# Altium schematic sheet isolated_rs485.SchDoc: foxBMS BMS-Extension
size A3; DocumentNumber: 9; SheetNumber: 9; SheetTotal: 14; Author: Fraunhofer IISB foxBMS Team; REL-DATE: 2017-05-16; VERSION: 1.0.2; GateName_1: G$1; SymbolName_1: FRAME_B_L; LibraryName: foxBMS_BMS-Master_V1.00_A; DeviceSetName: FRAME_B_L; GateName_2: G$2; SymbolName_2: DOCFIELD; SheetDescription: Isolated RS485
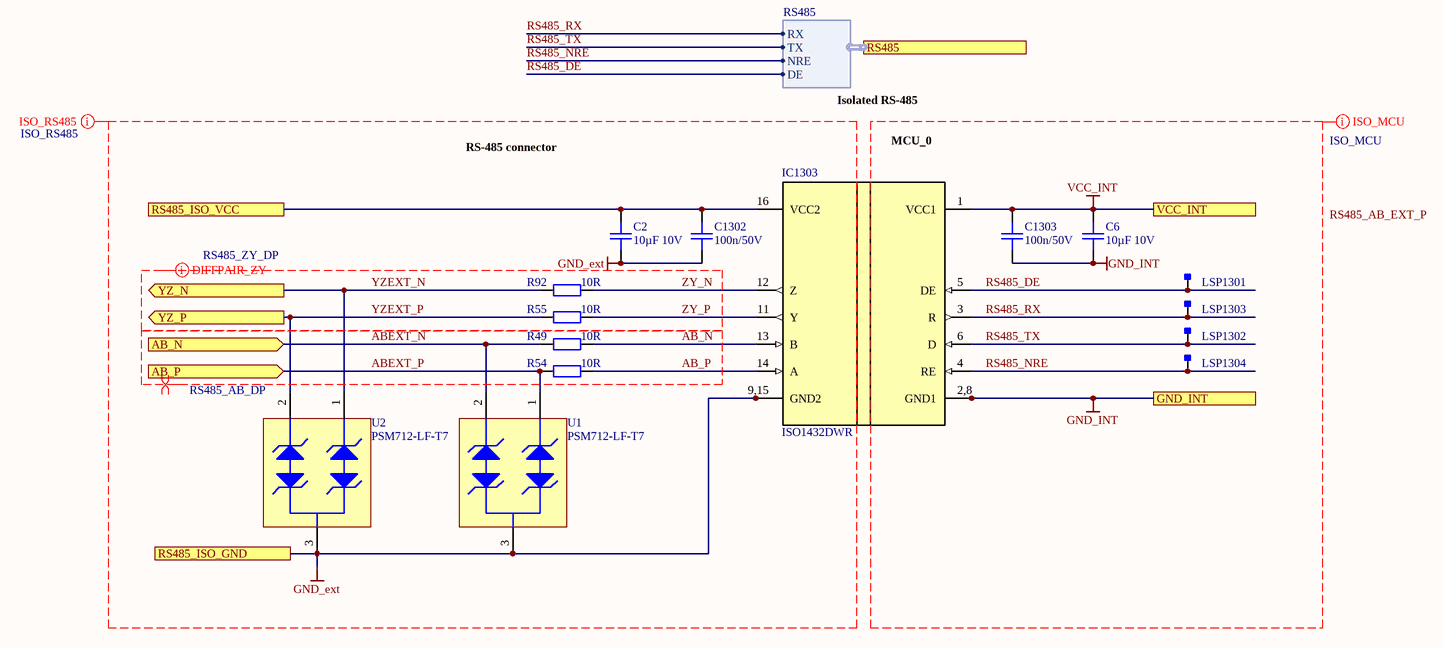
[diagram p0: isolated_rs485.SchDoc]

## Parts
C2  10µF 10V  [0805C]
C6  10µF 10V  [0805C]
C1302  100n/50V  [0603C]
C1303  100n/50V  [0603C]
IC1303  ISO1432DWR  [DW0016B_N]
LSP1301  Testpoint_Square  [Testpoint_S1]  (value not drawn)  (no BOM)
LSP1302  Testpoint_Square  [Testpoint_S1]  (value not drawn)  (no BOM)
LSP1303  Testpoint_Square  [Testpoint_S1]  (value not drawn)  (no BOM)
LSP1304  Testpoint_Square  [Testpoint_S1]  (value not drawn)  (no BOM)
R49  10R  [0603R]
R54  10R  [0603R]
R55  10R  [0603R]
R92  10R  [0603R]
U1  PSM712-LF-T7  [PRKT-SOT23-3_V]
U2  PSM712-LF-T7  [PRKT-SOT23-3_V]

## Ports
AB_N (in), AB_P (in), GND_INT, RS485 (harness RS485), RS485_ISO_GND, RS485_ISO_VCC, VCC_INT, YZ_N (out), YZ_P (out)

## Harnesses
RS485: RX, TX, NRE, DE

## Nets
GND_ext: C2.2 C1302.2 IC1303.9,15(GND2) IC1303.15 U1.3 U2.3 ; port RS485_ISO_GND
GND_INT: C6.2 C1303.2 IC1303.2,8(GND1) IC1303.8 ; port GND_INT
VCC_INT: C6.1 C1303.1 IC1303.1(VCC1) ; port VCC_INT
AB_N: IC1303.13(B) R49.2
AB_P: IC1303.14(A) R54.2
ABEXT_N: R49.1 U1.2 ; port AB_N
ABEXT_P: R54.1 U1.1 ; port AB_P
RS485_DE: IC1303.5(DE) LSP1301.1 ; port RS485.DE
RS485_ISO_VCC: C2.1 C1302.1 IC1303.16(VCC2) ; port RS485_ISO_VCC
RS485_NRE: IC1303.4(RE) LSP1304.1 ; port RS485.NRE
RS485_RX: IC1303.3(R) LSP1303.1 ; port RS485.RX
RS485_TX: IC1303.6(D) LSP1302.1 ; port RS485.TX
YZEXT_N: R92.1 U2.1 ; port YZ_N
YZEXT_P: R55.1 U2.2 ; port YZ_P
ZY_N: IC1303.12(Z) R92.2
ZY_P: IC1303.11(Y) R55.2

Not connected (* = marked no-connect by the designer): IC1303 7(NC) 10(NC)

## Layout directives
net class ISO_MCU: GND_INT, RS485_DE, RS485_NRE, RS485_RX, RS485_TX, VCC_INT
net class ISO_RS485: AB_N, AB_P, ABEXT_N, ABEXT_P, GND_ext, YZEXT_N, YZEXT_P, ZY_N, ZY_P
differential pair; differential pair class RS485_ZY_DP; rule Differential Pairs Routing [Pref Gap = 0.65mm    Min Gap  = 0.127mm    Max Gap  = 2mmPref Width = 0.152mm    Min Width  = 0.024mm    Max Width  = 0.279mm]: YZEXT_N, YZEXT_P, ZY_N, ZY_P
differential pair; differential pair class RS485_AB_DP; rule Differential Pairs Routing [Pref Gap = 0.65mm    Min Gap  = 0.127mm    Max Gap  = 2mmPref Width = 0.152mm    Min Width  = 0.024mm    Max Width  = 0.279mm]: AB_N, AB_P, ABEXT_N, ABEXT_P

## Notes on the sheet
- Isolated RS-485
- RS-485 connector
- MCU_0
- Labels drawn without touching a wire or pin: RS485_AB_EXT_P
- Fraunhofer IISB
- Schottkystr. 10
- developed by:
- 91058 Erlangen
- Germany
- Author
- Project
- License
- Description
- File
- Version
- Release Date
- Sheet
- www.foxbms.org
- www.iisb.fraunhofer.de
- foxBMS Team
- /

## Library data of the parts
C2 C6 = gen_C_ceramic_10u_10V_X7R_0805: Ceramic, 10µF, ±10%, 10V, X7R, –55 to 125°C, 0805 (2012),RoHS, Automotive; Part Number: GCJ21BR71A106KE01; Manufacturer: Murata; Case EIA: 0805; Case Metric: 2012; Automotive Qualified: True; PnP Package: C_0805_10; PnP Value: 10µF/10V/X7R; Capacitance: 10µF; Rated Voltage: 10V; Dielectric: X7R; Supplier 1: Digi-Key; Supplier Part Number 1: 490-12646-1-ND; Height - Seated (Max): 1.25mm; Mounting Type: SurfaceMount,MLCC; Operating Temperature: –55 to 125°C; Series: GCJ; Tolerance: ±10%; Manufacturer_Part_Number: GCJ21BR71A106KE01
C1302 C1303 = gen_C_ceramic_100n_50V_X7R_0603: MLCC; Capacitance: 100n; Rated Voltage: 50V; Dielectric: X7R; Case EIA: 0603; Case Metric: 1608; PnP Package: C_0603_10; PnP Value: 100n/50V/X7R; PnP equipped: x; Part Number: gen_C_ceramic_100n_50V_X7R_0603; Supplier 1: Farnell; Supplier Part Number 1: 2525267
IC1303 = ISO1432DWR: 5-kVrms isolated RS-485/RS-422 transceiver with robust EMC; Manufacturer: Texas Instruments; PartNumber: ISO1432DWR; RefDes: RefDes; TYPE: TYPE; Value: Value; Part Number: ISO1432DWR
LSP1301-LSP1304 = Testpoint_Square: Testpoint, square; Part Number: Testpoint_Square
R49 R54 R55 R92 = gen_R_10R_0603: SMD Resistor 10R 0603; Tolerance: 1%; Power: 0.1W; Case EIA: 0603; Case Metric: 1608; Maximum Working Voltage: 75V; PnP Package: R_0603; Automotive Qualified: False; Part Number: gen_R_10R_0603; Operating Temperature: -55°C - +155°C; Resistance: 10R; Series: E24, E96; PnP Value: 10R; Supplier 1: Farnell; Supplier Part Number 1: 2073361
U1 U2 = CMP-2000-07553-1: TVS Array - Asymmetrical Data Line Protector, 600 W, 7.5 V, -55 to 150 degC, 3-Pin SOT23, RoHS, Tape and Reel; Manufacturer: Protek Devices; Min Breakdown Voltage: 7.5V; Direction: Bidirectional; Capacitance: 75pF; Current: 20uA; Power Dissipation: 600W; Working Voltage: 7V; Voltage: 12V; Case\/Package: SOT-23; Clamping Voltage: 17V; Element Configuration: Dual; Mounting Technology: SurfaceMount; RoHSCompliant: True; Radiation Hardening: No; Depth: 1.4mm; Lead Free: LeadFree; Package Description: 3-Pin Small Outline Transistor, Body 2.92 x 1.3 mm, Pitch 0.94 mm; Max Operating Temperature: 150degC; Length: 3.04mm; Manufacturer URL: http://www.protekdevices.com/; Min Operating Temperature: -55degC; Leakage Current: 20uA; Datasheet URL: www.protekdevices.com/xyz/documents/datasheets/psm712.pdf; Packaging: TapeandReel; Datasheet Version: 10/2013; Package Reference: SOT23-3; Number of Pins: 3